# Altium schematic sheet TopLevel.SchDoc
size A4; SheetNumber: 1; SheetTotal: 7
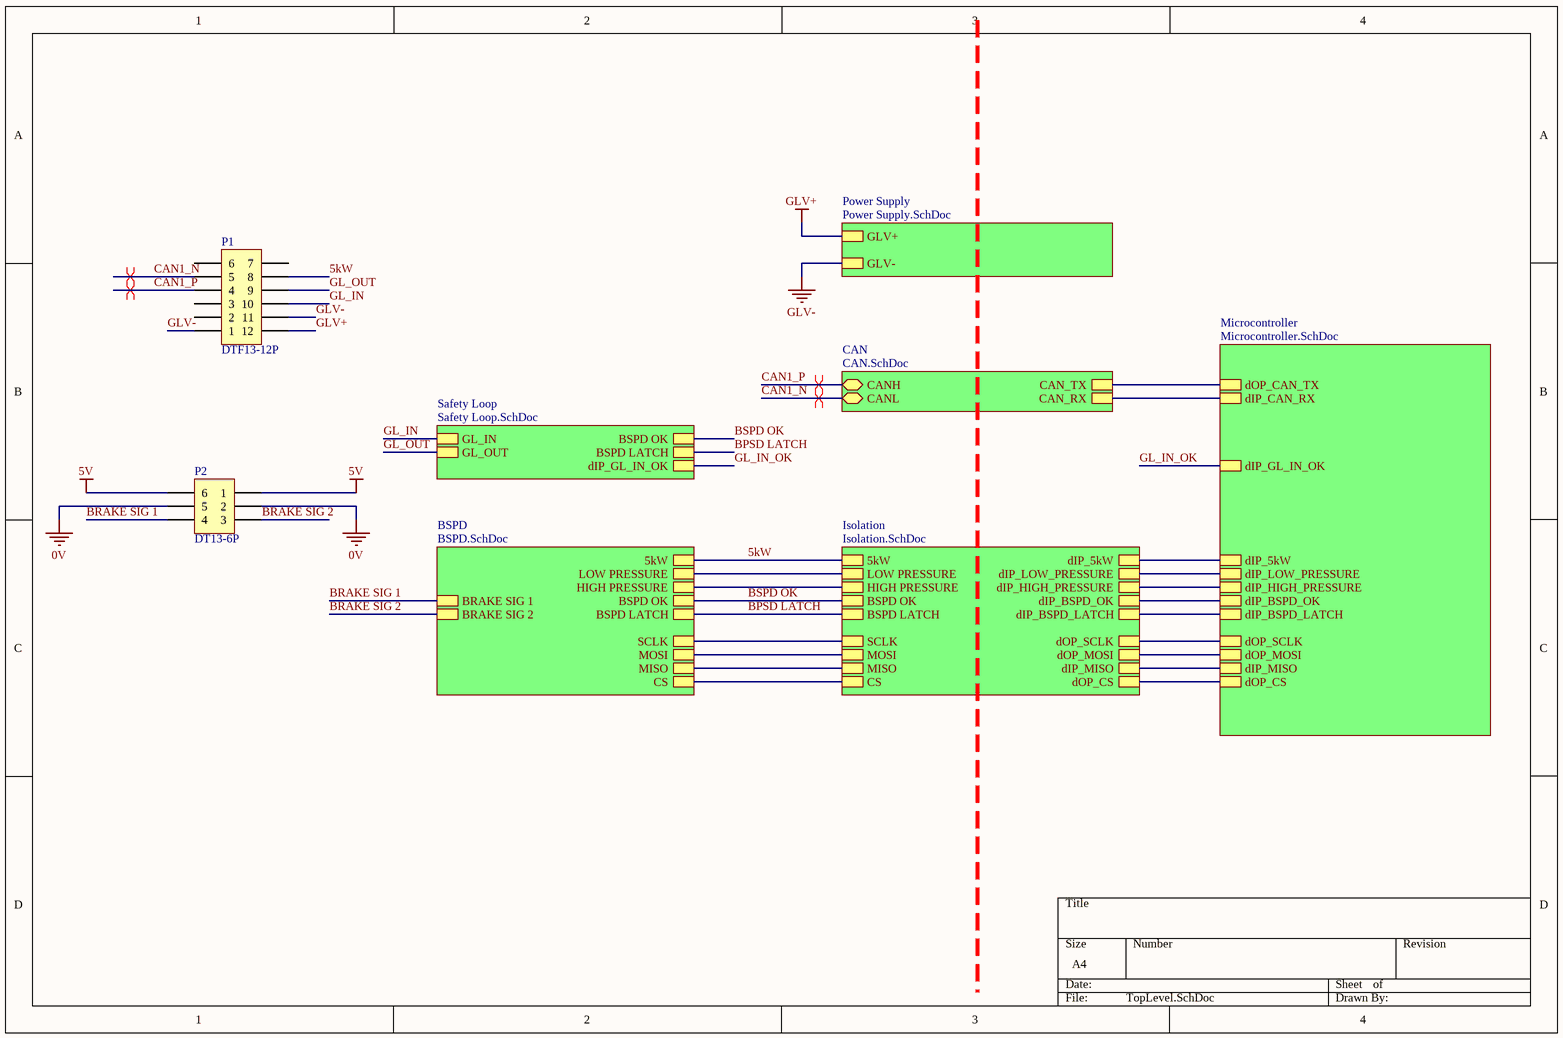
[diagram p0: TopLevel.SchDoc]

## Parts
P1  DTF13-12P  [DTF13-12P]
P2  DT13-6P  [DTF13-6P]

## Sub-sheets
BSPD = BSPD.SchDoc: 5kW, BSPD OK, BSPD LATCH, SCLK, MOSI, MISO, CS, BRAKE SIG 1, BRAKE SIG 2, HIGH PRESSURE, LOW PRESSURE
CAN = CAN.SchDoc: CANH (bidir), CANL (bidir), CAN_TX, CAN_RX
Isolation = Isolation.SchDoc: 5kW, BSPD OK, BSPD LATCH, SCLK, MOSI, MISO, CS, HIGH PRESSURE, LOW PRESSURE, dIP_5kW, dIP_LOW_PRESSURE, dIP_HIGH_PRESSURE, dIP_BSPD_OK, dIP_BSPD_LATCH, dOP_CS, dOP_MOSI, dIP_MISO, dOP_SCLK
Microcontroller = Microcontroller.SchDoc: dOP_CAN_TX, dIP_CAN_RX, dIP_5kW, dIP_LOW_PRESSURE, dIP_HIGH_PRESSURE, dIP_BSPD_OK, dIP_BSPD_LATCH, dOP_SCLK, dOP_MOSI, dIP_MISO, dOP_CS, dIP_GL_IN_OK
Power Supply = Power Supply.SchDoc: GLV+, GLV-
Safety Loop = Safety Loop.SchDoc: BSPD OK, BSPD LATCH, GL_IN, GL_OUT, dIP_GL_IN_OK

## Nets
0V: P2.2 P2.5
5V: P2.1 P2.6
GLV+: P1.12 ; sheet Power Supply/GLV+
GLV-: P1.1 P1.11 ; sheet Power Supply/GLV-
5kW: P1.8 ; sheet Isolation/5kW, sheet BSPD/5kW
BPSD LATCH: sheet Isolation/BSPD LATCH, sheet BSPD/BSPD LATCH, sheet Safety Loop/BSPD LATCH
BRAKE SIG 1: P2.4 ; sheet BSPD/BRAKE SIG 1
BRAKE SIG 2: P2.3 ; sheet BSPD/BRAKE SIG 2
BSPD OK: sheet Isolation/BSPD OK, sheet BSPD/BSPD OK, sheet Safety Loop/BSPD OK
CAN1_N: P1.5 ; sheet CAN/CANL
CAN1_P: P1.4 ; sheet CAN/CANH
GL_IN: P1.10 ; sheet Safety Loop/GL_IN
GL_IN_OK: sheet Microcontroller/dIP_GL_IN_OK, sheet Safety Loop/dIP_GL_IN_OK
GL_OUT: P1.9 ; sheet Safety Loop/GL_OUT
(unnamed): sheet CAN/CAN_TX, sheet Microcontroller/dOP_CAN_TX
(unnamed): sheet CAN/CAN_RX, sheet Microcontroller/dIP_CAN_RX
(unnamed): sheet Isolation/SCLK, sheet BSPD/SCLK
(unnamed): sheet Isolation/MOSI, sheet BSPD/MOSI
(unnamed): sheet Isolation/MISO, sheet BSPD/MISO
(unnamed): sheet Isolation/CS, sheet BSPD/CS
(unnamed): sheet Isolation/HIGH PRESSURE, sheet BSPD/HIGH PRESSURE
(unnamed): sheet Isolation/LOW PRESSURE, sheet BSPD/LOW PRESSURE
(unnamed): sheet Isolation/dIP_5kW, sheet Microcontroller/dIP_5kW
(unnamed): sheet Isolation/dIP_LOW_PRESSURE, sheet Microcontroller/dIP_LOW_PRESSURE
(unnamed): sheet Isolation/dIP_HIGH_PRESSURE, sheet Microcontroller/dIP_HIGH_PRESSURE
(unnamed): sheet Isolation/dIP_BSPD_OK, sheet Microcontroller/dIP_BSPD_OK
(unnamed): sheet Isolation/dIP_BSPD_LATCH, sheet Microcontroller/dIP_BSPD_LATCH
(unnamed): sheet Isolation/dOP_CS, sheet Microcontroller/dOP_CS
(unnamed): sheet Isolation/dOP_MOSI, sheet Microcontroller/dOP_MOSI
(unnamed): sheet Isolation/dIP_MISO, sheet Microcontroller/dIP_MISO
(unnamed): sheet Isolation/dOP_SCLK, sheet Microcontroller/dOP_SCLK

Not connected (* = marked no-connect by the designer): P1 2 3 6 7

## Layout directives
differential pair: CAN1_N, CAN1_P

## Library data of the parts
P1 = DTF13-12P: Positions: 12; Pitch: 4.45mm; Angle: 90; Flange: No; Contact: Copper Alloy; Part Number: DTF13-12P; Row Spacing: 4.45mm; Digikey Part Number: 1734-1861-ND; Digikey Link: https://www.digikey.com/products/en?keywords=dtf13-12pa
P2 = DTF13-6P: Positions: 6; Pitch: 4.45mm; Angle: 90; Flange: No; Contact: Copper Alloy; Part Number: DTF13-6P; Row Spacing: 4.45mm; Digikey Part Number: 1734-1754-ND; Digikey Link: https://www.digikey.com/products/en?keywords=DTF13-6P